# EAGLE design dac2b-only (EAGLE 6.5.0)
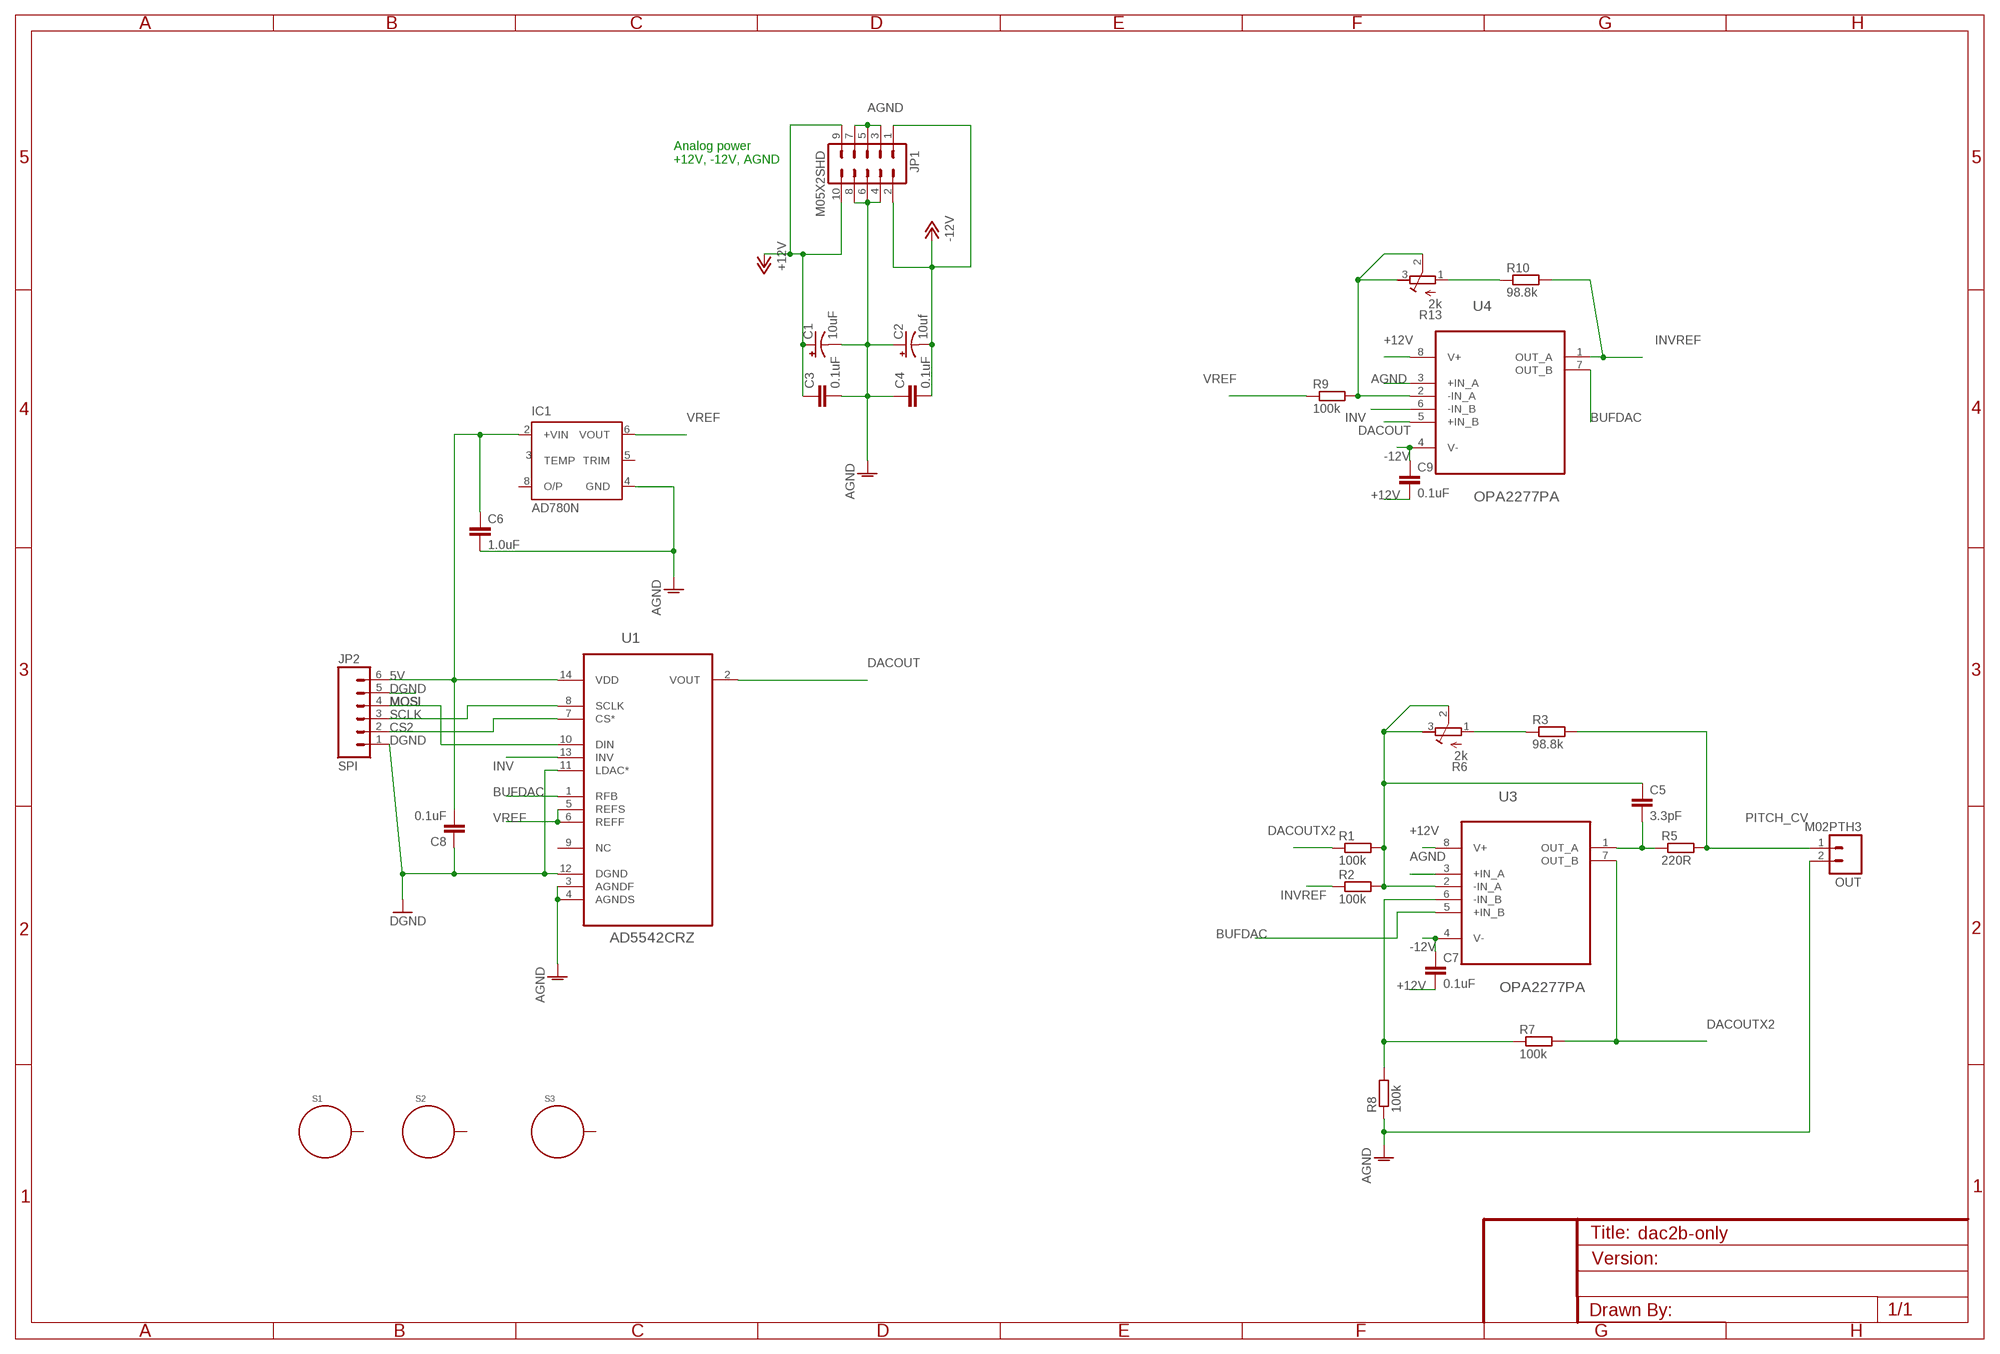
[diagram p0: schematic, sheet 1]

## Parts
C1  10uF  CAP_POLPTH1  [CPOL-RADIAL-100UF-25V]
C2  10uf  CAP_POLPTH1  [CPOL-RADIAL-100UF-25V]
C3  0.1uF  C-EU050-055X075  [C050-055X075]
C4  0.1uF  C-EU050-055X075  [C050-055X075]
C5  3.3pF  C-EU025-025X050  [C025-025X050]
C6  1.0uF  C-EU075-032X103  [C075-032X103]
C7  0.1uF  C-EU025-025X050  [C025-025X050]
C8  0.1uF  C-EU050-055X075  [C050-055X075]
C9  0.1uF  C-EU025-025X050  [C025-025X050]
IC1  AD780N  [DIL08]
JP1  M05X2SHD  [2X5-SHROUDED]
JP2  SPI  M06SIP  [1X06]
OUT  M02PTH3  [1X02_LONGPADS]
R1  100k  R-EU_0207/10  [0207/10]
R2  100k  R-EU_0207/10  [0207/10]
R3  98.8k  R-EU_0207/10  [0207/10]
R5  220R  R-EU_0207/10  [0207/10]
R6  2k  R-TRIMM3296W  [RTRIM3296W]
R7  100k  R-EU_0207/10  [0207/10]
R8  100k  R-EU_0207/10  [0207/10]
R9  100k  R-EU_0207/10  [0207/10]
R10  98.8k  R-EU_0207/10  [0207/10]
R13  2k  R-TRIMM3296W  [RTRIM3296W]
S1  STANDOFF_ELECTRICAL  [STANDOFF-ELECTRICAL]
S2  STANDOFF_ELECTRICAL  [STANDOFF-ELECTRICAL]
S3  STANDOFF_ELECTRICAL  [STANDOFF-ELECTRICAL]
U1  AD5542CRZ  [SOIC127P600X175-14N]
U3  OPA2277PA  [DIP254P762X508-8]
U4  OPA2277PA  [DIP254P762X508-8]

## Nets
5V: C6.1 C8.2 IC1.2(+VIN) JP2.6 U1.14(VDD)
+12V: C1.1(+) C3.1 C7.2 C9.2 JP1.9 JP1.10 U3.8(V+) U4.8(V+)
-12V: C2.2(-) C4.2 C7.1 C9.1 JP1.1 JP1.2 U3.4(V-) U4.4(V-)
AGND: C1.2(-) C2.1(+) C3.2 C4.1 C6.2 IC1.4(GND) JP1.3 JP1.4 JP1.5 JP1.6 JP1.7 JP1.8 OUT.2 R8.1 U1.3(AGNDF) U1.4(AGNDS) U3.3(+IN_A) U4.3(+IN_A)
BUFDAC: U1.1(RFB) U3.5(+IN_B) U4.7(OUT_B)
CS2: JP2.2 U1.7(CS*)
DACOUT: U1.2(VOUT) U4.5(+IN_B)
DACOUTX2: R1.1 R7.2 U3.7(OUT_B)
DGND: C8.1 JP2.1 JP2.5 U1.11(LDAC*) U1.12(DGND)
INV: U1.13(INV) U4.6(-IN_B)
INVREF: R2.1 R10.2 U4.1(OUT_A)
MOSI: JP2.4 U1.10(DIN)
N$1: R9.2 R13.2(S) R13.3(A) U4.2(-IN_A)
N$2: C5.2 R5.1 U3.1(OUT_A)
N$3: R10.1 R13.1(E)
N$4: C5.1 R1.2 R2.2 R6.2(S) R6.3(A) U3.2(-IN_A)
N$5: R7.1 R8.2 U3.6(-IN_B)
N$12: R3.1 R6.1(E)
PITCH_CV: OUT.1 R3.2 R5.2
SCLK: JP2.3 U1.8(SCLK)
VREF: IC1.6(VOUT) R9.1 U1.5(REFS) U1.6(REFF)
Unconnected: IC1.3(TEMP) IC1.5(TRIM) IC1.8(O/P) S1.P1 S2.P1 S3.P1 U1.9(NC)

## Notes on the sheet
- Analog power
  +12V, -12V, AGND

## Library data of the parts
C1 C2 = SparkFun-Passives:CAP_POL: Capacitor Polarized These are standard SMD and PTH capacitors. Normally 10uF, 47uF, and 100uF in electrolytic and tantalum varieties. Always verify the external diameter of the through hole cap, it varies with capacity, voltage, and manufacturer. The EIA devices should be standard.
C3-C5 C7-C9 = resistor:C-EU: CAPACITOR, European symbol
C6 = rcl:C-EU: CAPACITOR, European symbol
IC1 = analog-devices-3:AD780: High Precision Reference 2.5V/3.0V Source: http://www.analog.com/UploadedFiles/Data_Sheets/AD780.pdf
JP1 = SparkFun-Connectors:M05X2: Header 5x2 Standard 10-pin dual row 0.1" header. Commonly used with AVR-ISP. Use with Spark Fun Electronics SKU: PRT-00778
JP2 = SparkFun-Connectors:M06: Header 6 Standard 6-pin 0.1" header. Use with straight break away headers (SKU : PRT-00116), right angle break away headers (PRT-00553), swiss pins (PRT-00743), machine pins (PRT-00117), and female headers (PRT-00115). Molex polarized connector foot print use with SKU : PRT-08094 with associated crimp pins and housings. NOTES ON THE VARIANTS LOCK and LOCK_LONGPADS... This footprint was designed to help hold the alignment of a through-hole component (i.e. 6-pin header) while soldering it into place. You may notice that each hole has been shifted either up or down by 0.005 of an inch from it's more standard position (which is a perfectly straight line). This slight alteration caused the pins (the squares in the middle) to touch the edges of the holes. Because they are alternating, it causes a "brace" to hold the component in place. 0.005 has proven to be the perfect amount of "off-center" position when using our standard breakaway headers. Although looks a little odd when you look at the bare footprint, once you have a header in there, the alteration is very hard to notice. Also,if you push a header all the way into place, it is covered up entirely on the bottom side. This idea of altering the position of holes to aid alignment will be further integrated into the Sparkfun Library for other footprints. It can help hold any component with 3 or more connection pins.
OUT = SparkFun-Connectors:M02: Standard 2-pin 0.1" header. Use with - straight break away headers ( PRT-00116) - right angle break away headers (PRT-00553) - swiss pins (PRT-00743) - machine pins (PRT-00117) - female headers (PRT-00115) Molex polarized connector foot print use with: PRT-08233 with associated crimp pins and housings. 2.54_SCREWTERM for use with PRT-10571. 3.5mm Screw Terminal footprints for PRT-08084 5mm Screw Terminal footprints for use with PRT-08433
R1-R3 R5 R7-R10 = resistor:R-EU_: RESISTOR, European symbol
R6 R13 = resistor:R-TRIMM: Trimm resistor
S1-S3 = SparkFun-Electromechanical:STANDOFF_ELECTRICAL: A standoff intended to be an electrically connected point. Pad size and stop size allow for a #4 Phillips pan screw head to make a solid connection to the board.
U1 = chris-dac-adc:AD5542CRZ: SOIC-14,16-Bit DACs; MPN: AD5542CRZ; OC_FARNELL: 1438374; OC_NEWARK: 12M8556; PACKAGE: SOIC-14; SUPPLIER: Analog Devices
U3 U4 = chris-opamps:OPA2277PA: OPERATIONAL AMPLIFIER; MPN: OPA2277PA; OC_FARNELL: 1470393; OC_NEWARK: 80K6021; PACKAGE: PDIP; SUPPLIER: Texas Instruments

## Board
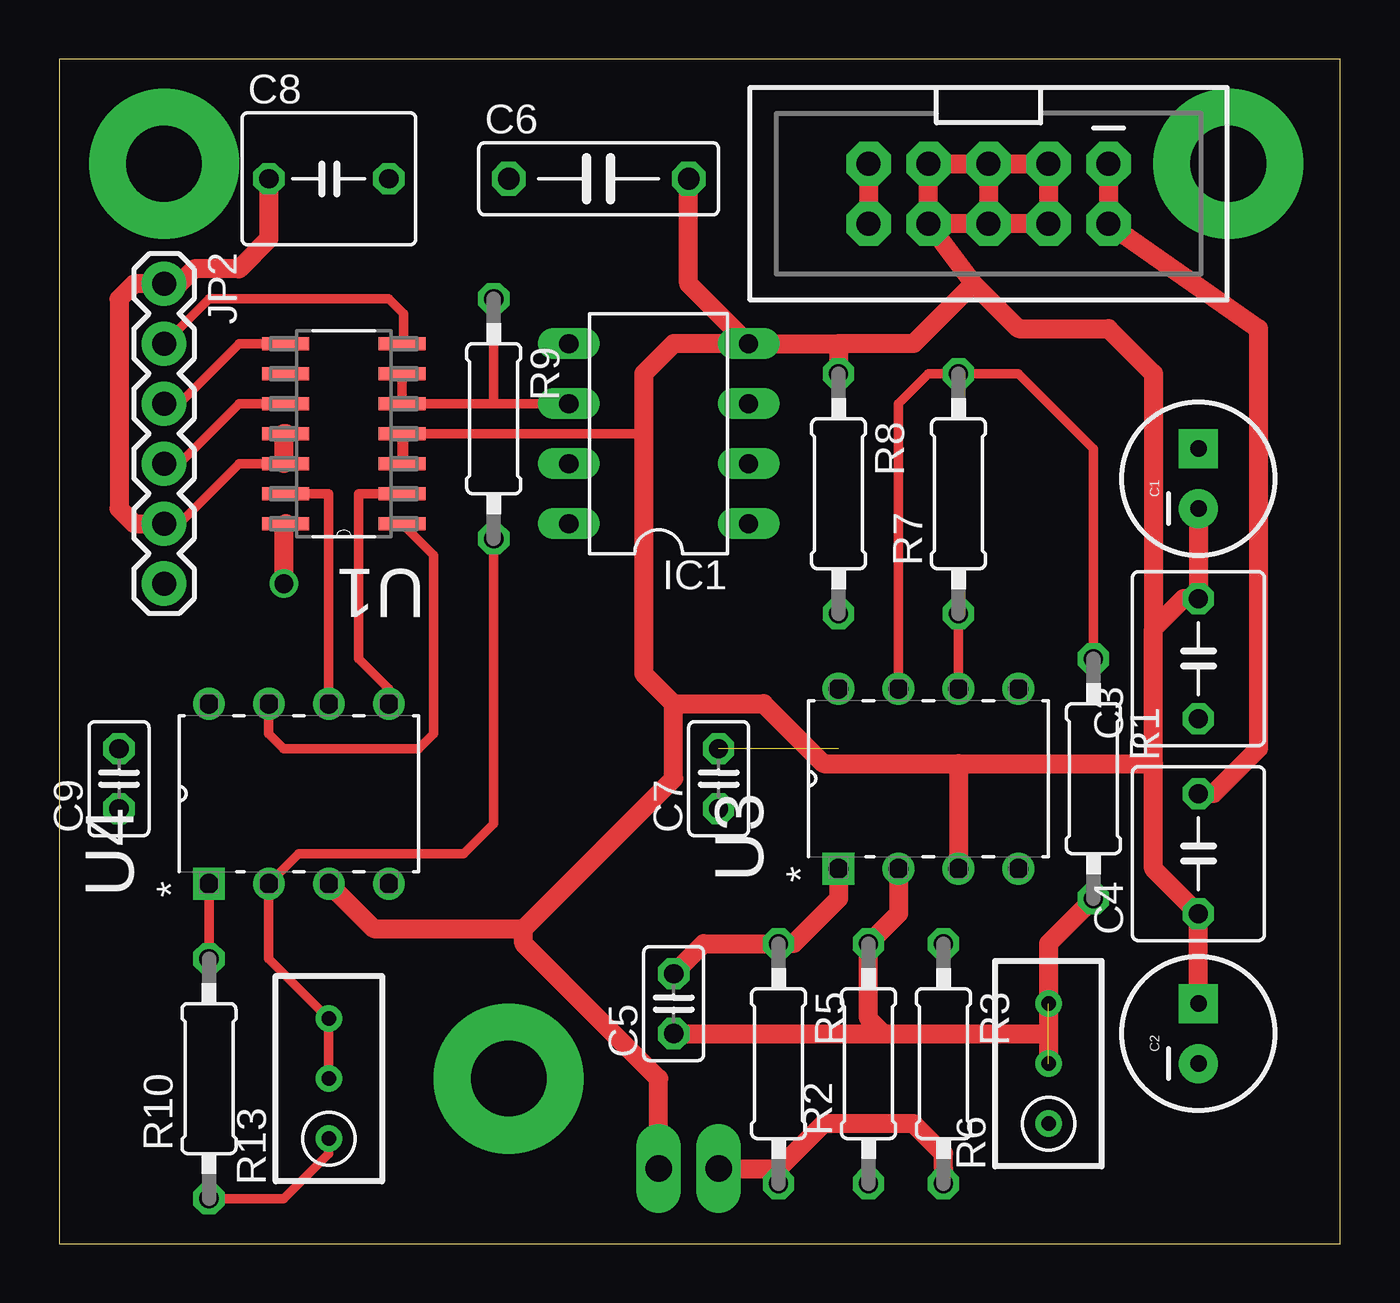
[diagram p1: board, top side]
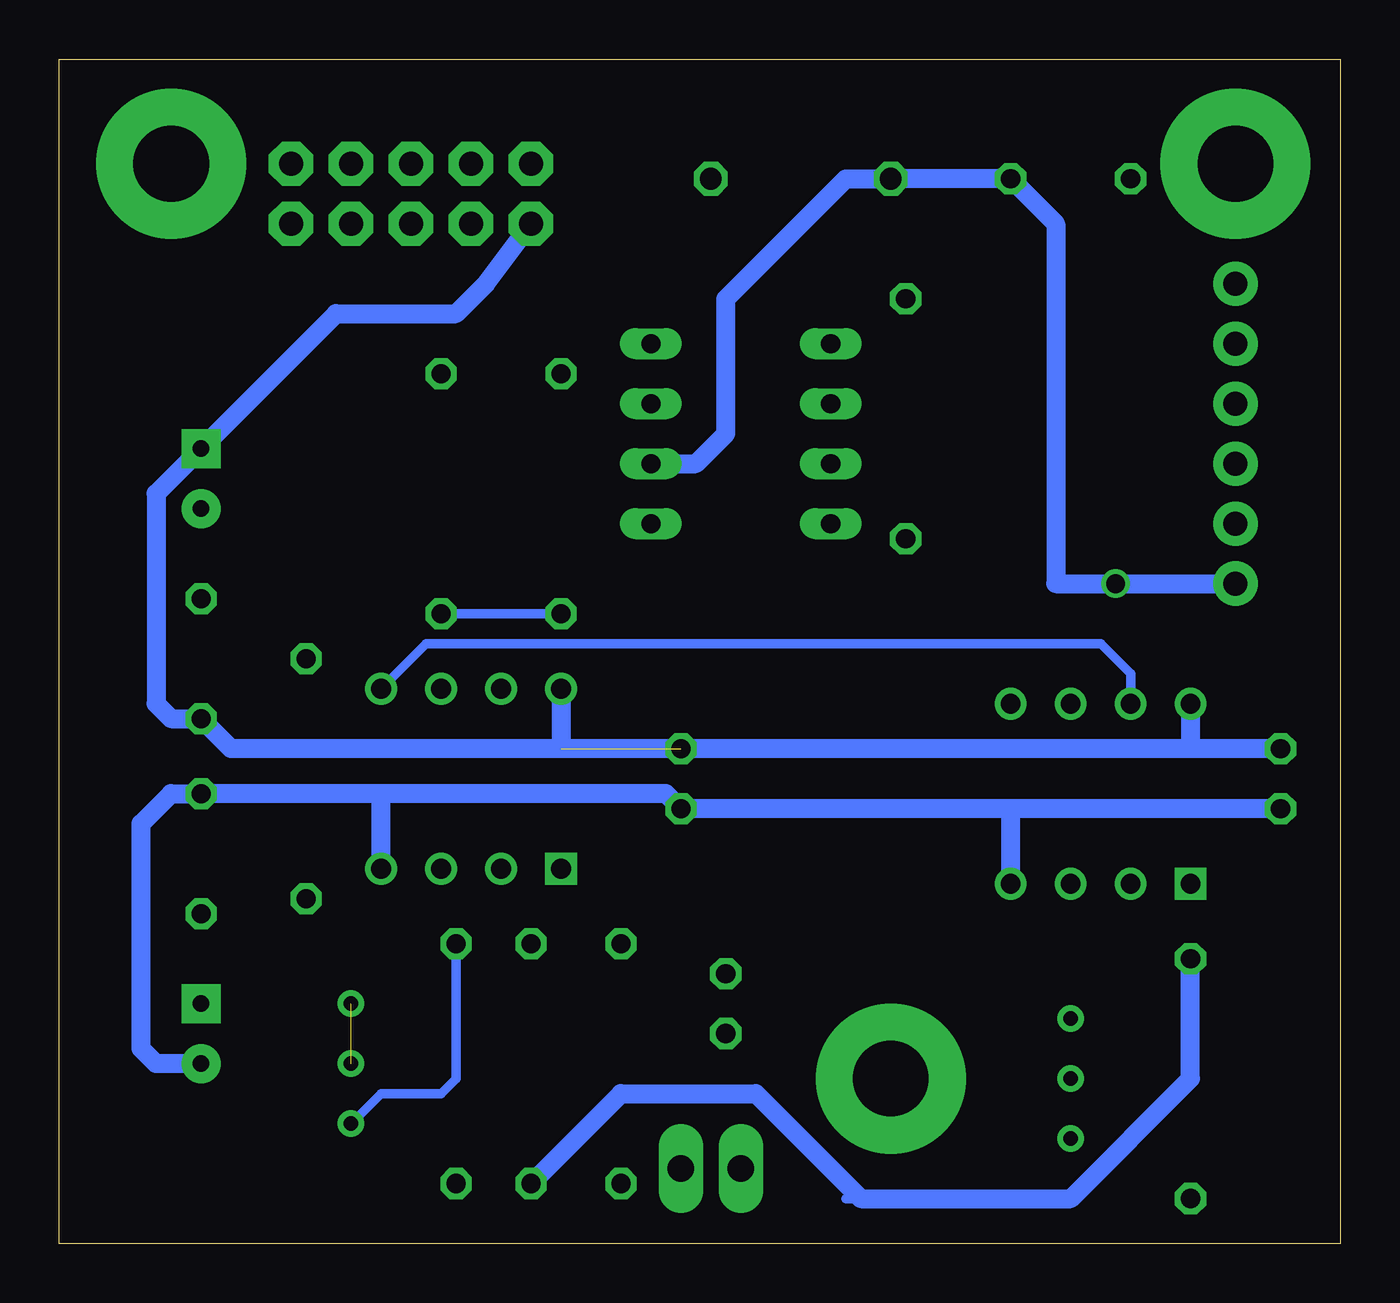
[diagram p2: board, bottom side, seen from below]

Size 54.28 x 50.15 mm. Coordinates in mm from the lower left corner, seen from the top.
Outline: 0,0 54.28,0 54.28,50.15 0,50.15 0,0
Copper layers (1*16): Top 0.035mm / dielectric 1.5mm / Bottom 0.035mm
Design rules "default": minimum track width 10mil, minimum drill 24mil, track to track 8mil, track to pad 8mil, pad to pad 8mil, via to via 8mil, smd to smd 8mil, copper to edge 40mil, drill to drill 8mil, minimum pad ring 10mil, minimum via ring 8mil, stop-mask expansion 4mil, vias tented up to drill 0mil, thermal gap 10mil

### Footprints (pad centres in the part's own frame; a part is rotated, then mirrored left to right if it is on the bottom)
CPOL-RADIAL-100UF-25V = drill 0.7 pad 1.651 square: 1 1.27,0 | drill 0.7 pad 1.651: 2 -1.27,0
C050-055X075 = drill 0.813 octagon: 1 -2.54,0; 2 2.54,0
C025-025X050 = drill 0.813 octagon: 1 -1.27,0; 2 1.27,0
C075-032X103 = drill 0.914 octagon: 1 -3.81,0; 2 3.81,0
DIL08 = drill 0.813 long: 1 -3.81,-3.81; 2 -1.27,-3.81; 3 1.27,-3.81; 4 3.81,-3.81; 5 3.81,3.81; 6 1.27,3.81; 7 -1.27,3.81; 8 -3.81,3.81
2X5-SHROUDED = drill 1.016 pad 1.88 octagon: 1 -1.27,5.08; 2 1.27,5.08; 3 -1.27,2.54; 4 1.27,2.54; 5 -1.27,0; 6 1.27,0; 7 -1.27,-2.54; 8 1.27,-2.54; 9 -1.27,-5.08; 10 1.27,-5.08
1X06 = drill 1.016 pad 1.88: 1 0,0; 2 2.54,0; 3 5.08,0; 4 7.62,0; 5 10.16,0; 6 12.7,0
1X02_LONGPADS = drill 1.118 pad 1.88 long: 1 0,0; 2 2.54,0
0207/10 = drill 0.813 octagon: 1 -5.08,0; 2 5.08,0
RTRIM3296W = drill 0.61: 1 0,-2.54; 2 0,0; 3 0,2.54
STANDOFF-ELECTRICAL = drill 3.2 pad 6.35: P1 0,0
SOIC127P600X175-14N = smd 1.981 x 0.559: 1 -2.464,3.81; 2 -2.464,2.54; 3 -2.464,1.27; 4 -2.464,0; 5 -2.464,-1.27; 6 -2.464,-2.54; 7 -2.464,-3.81; 8 2.464,-3.81; 9 2.464,-2.54; 10 2.464,-1.27; 11 2.464,0; 12 2.464,1.27; 13 2.464,2.54; 14 2.464,3.81
DIP254P762X508-8 = drill 0.838 square: 1 -7.62,7.62 | drill 0.838: 2 -7.62,5.08; 3 -7.62,2.54; 4 -7.62,0; 5 0,0; 6 0,2.54; 7 0,5.08; 8 0,7.62

### Placement (x,y rotation side)
C1  48.26,32.38 90 top
C2  48.26,8.89 90 top
C3  48.26,24.77 90 top
C4  48.26,16.51 90 top
C5  26.04,10.16 90 top
C6  22.86,45.09 0 top
C7  27.94,19.69 90 top
C8  11.43,45.09 0 top
C9  2.54,19.69 90 top
IC1  25.4,34.29 90 top
JP1  39.37,44.45 270 top
JP2  4.45,40.64 270 top
OUT  27.94,3.18 180 top
R1  43.81,19.69 270 top
R2  34.29,7.62 90 top
R3  37.47,7.62 270 top
R5  30.48,7.62 270 top
R6  41.91,7.62 0 top
R7  38.1,31.75 90 top
R8  33.02,31.75 270 top
R9  18.41,34.92 270 top
R10  6.35,6.98 90 top
R13  11.43,6.98 0 top
S1  4.45,45.72 0 top
S2  19.05,6.98 0 top
S3  49.53,45.72 0 top
U1  12.07,34.29 180 top
U3  40.64,23.49 90 top
U4  13.97,22.86 90 top

### Tracks (layer width: path | path; a pad name or v marks a point on that pad's centre or on a via)
5V  (via drill 0.8)
  Top 0.813: U1.14 9.53,30.4 v9.53,27.94
  Bottom 0.813: IC1.2 27.31,33.02 26.04,34.29 26.04,40.01 20.96,45.09 C6.1 C8.2 12.07,43.18 12.07,27.94 v9.53,27.94 JP2.6
+12V  (1 unrouted)
  Top 0.813: JP1.9 JP1.10
  Bottom 0.813: C9.2 6.35,20.95 | 6.35,20.95 33.02,20.95 | 33.02,20.95 46.99,20.95 C3.1 49.53,22.23 50.17,22.86 50.17,31.75 C1.1 42.55,39.37 37.47,39.37 36.19,40.64 JP1.10 | U4.8 6.35,20.95 | U3.8 33.02,20.95
-12V
  Top 0.813: JP1.1 JP1.2 50.8,38.74 50.8,20.95 48.89,19.05 C4.2
  Bottom 0.813: C9.1 13.97,18.41 | 13.97,18.41 C7.1 28.57,19.05 40.64,19.05 | 40.64,19.05 C4.2 49.53,19.05 50.8,17.78 50.8,8.26 50.17,7.62 C2.2 | U4.4 13.97,18.41 | U3.4 40.64,19.05
AGND
  Top 0.406: U1.4 U1.3 14.61,33.1 14.61,34.29 24.77,34.29
  Top 0.813: JP1.5 JP1.3 JP1.4 JP1.6 | JP1.6 JP1.8 | JP1.8 JP1.7 JP1.5 | JP1.5 JP1.6 | C2.1 C4.1 46.36,15.88 46.36,20.32 | C1.2 C3.2 47.62,27.3 46.36,26.04 | 46.36,20.32 46.36,26.04 | IC1.4 33.02,38.1 | 33.02,38.1 R8.1 | JP1.8 38.73,40.64 | 33.02,38.1 36.19,38.1 38.73,40.64 | 38.73,40.64 40.64,38.74 44.45,38.74 46.36,36.83 46.36,26.04 | 38.1,20.32 46.36,20.32 | C6.2 26.67,40.64 IC1.4 | IC1.4 26.04,38.1 24.77,36.83 24.77,34.29 24.77,24.13 26.04,22.86 | 26.04,22.86 29.85,22.86 32.39,20.32 38.1,20.32 | 38.1,20.32 U3.3 | U4.3 13.34,13.34 19.68,13.34 | 19.68,13.34 26.04,19.69 26.04,22.86 | 19.68,13.34 19.68,12.7 25.4,6.98 OUT.2
BUFDAC
  Top 0.406: 14.61,30.48 U1.1 15.88,29.13 15.88,21.59 15.24,20.95 9.53,20.95 8.89,21.59 U4.7
  Bottom 0.406: U3.5 38.73,25.4 10.16,25.4 8.89,24.13 U4.7
CS2
  Top 0.406: U1.7 14.61,38.18 14.61,39.37 13.97,40.01 6.35,40.01 JP2.2
DACOUT
  Top 0.406: U1.2 12.7,31.75 12.7,24.77 13.97,23.49 U4.5
DACOUTX2
  Top 0.406: U3.7 35.56,35.56 36.83,36.83 R7.2 40.64,36.83 43.81,33.66 R1.1
DGND
  Top 0.406: U1.11 U1.12 9.53,33.02 7.62,33.02 5.08,30.48 JP2.5
  Top 0.813: C8.1 8.89,42.54 7.62,41.27 5.71,41.27 5.08,40.64 JP2.1 3.18,40.64 2.54,40.01 2.54,31.12 3.18,30.48 JP2.5 | U1.11 9.53,34.29 9.53,33.02
INV
  Top 0.406: U1.13 11.43,31.75 U4.6
INVREF
  Top 0.406: U4.1 R10.2
  Bottom 0.406: 20.96,1.91 20.32,1.91
  Bottom 0.813: R2.1 30.48,6.35 24.77,6.35 20.32,1.91 11.43,1.91 6.35,6.98 R10.2
MOSI
  Top 0.406: U1.10 7.62,35.56 5.08,33.02 JP2.4
N$1
  Top 0.406: R9.2 18.41,17.78 17.14,16.51 10.16,16.51 U4.2 8.89,12.06 R13.3 R13.2
N$2
  Top 0.406: 29.85,12.7 R5.1
  Top 0.813: U3.1 33.02,14.6 31.11,12.7 R5.1 27.31,12.7 C5.2
N$3
  Top 0.406: R10.1 9.53,1.91 11.43,3.81 R13.1
N$4  (2 unrouted)
  Top 0.406: 34.29,11.43 R2.2
  Top 0.813: U3.2 35.56,13.97 R2.2 34.29,9.52 34.92,8.89 | C5.1 34.92,8.89 | 34.92,8.89 41.91,8.89 | R1.2 41.91,12.7 R6.2
N$5
  Top 0.406: U3.6 R7.1
  Bottom 0.406: R8.2 R7.1
N$12
  Bottom 0.406: R6.1 40.64,6.35 38.1,6.35 37.47,6.98 R3.1
PITCH_CV
  Top 0.406: 37.47,3.18 R3.2
  Top 0.813: 37.47,3.18 37.47,3.81 36.19,5.08 32.39,5.08 30.48,3.18 | 30.48,3.18 R5.2 | OUT.1 30.48,3.18
SCLK
  Top 0.406: U1.8 7.62,38.1 5.08,35.56 JP2.3
VREF
  Top 0.406: IC1.6 18.41,35.56 | 18.41,35.56 U1.5 U1.6 | R9.1 18.41,35.56